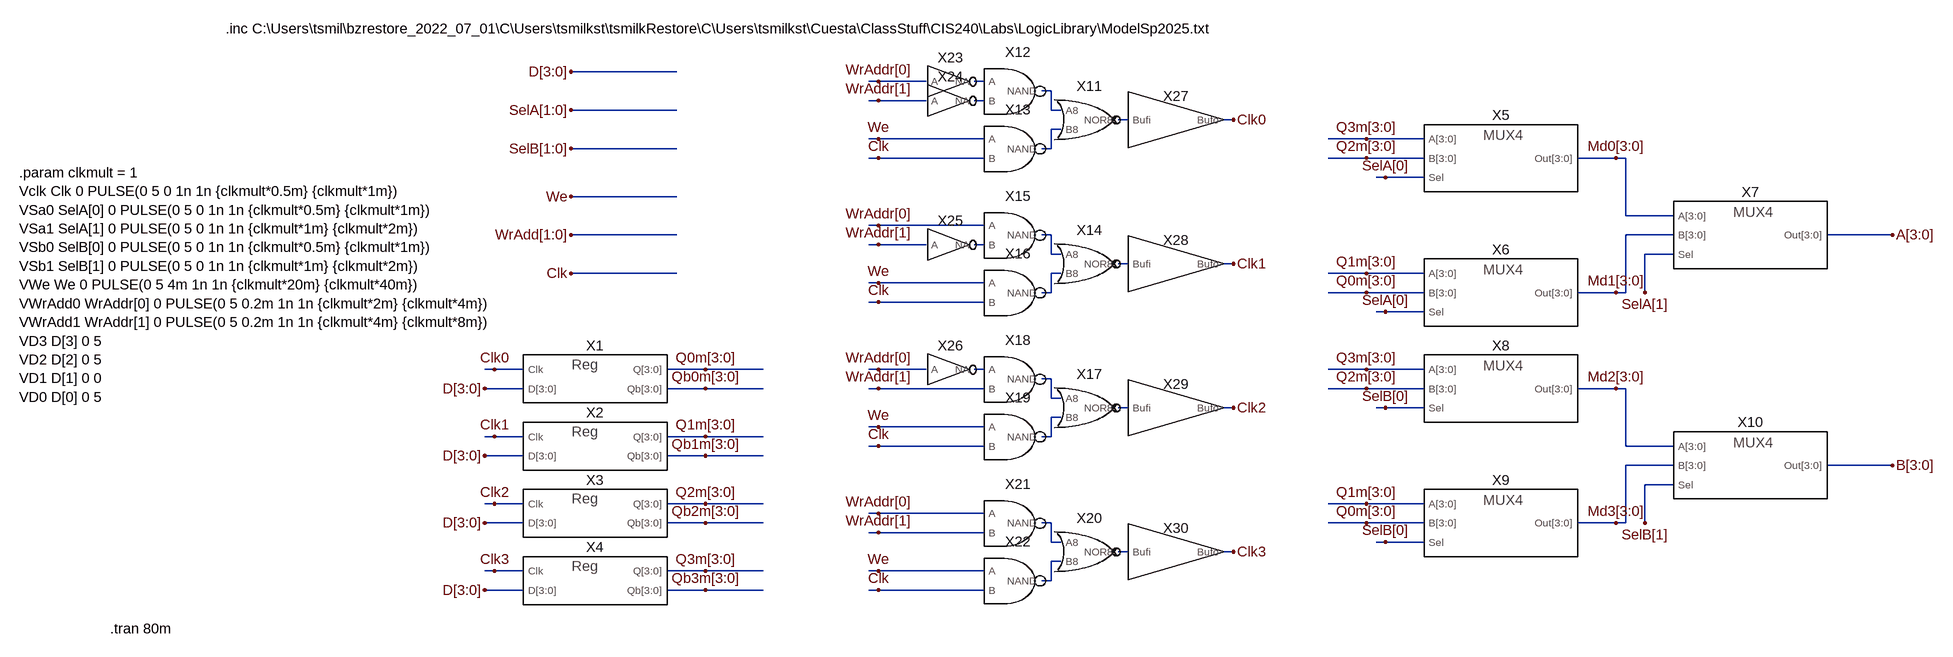
[diagram p0: schematic REGISTERBANKRAWTEST.asc]
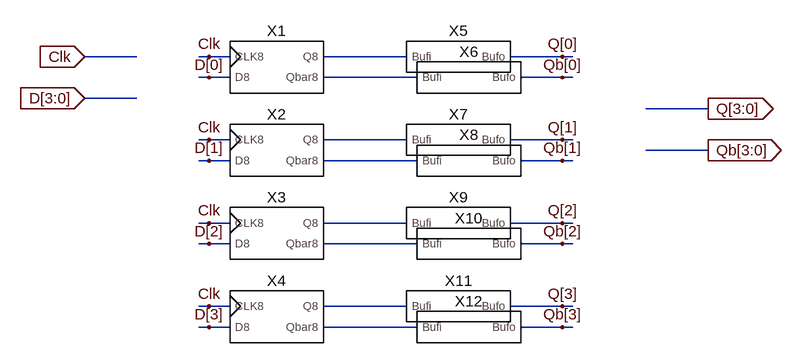
[diagram p1: sub-circuit register.asc]
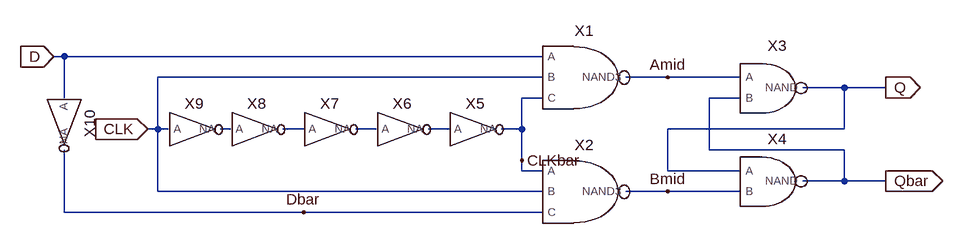
[diagram p2: sub-circuit dff.asc]
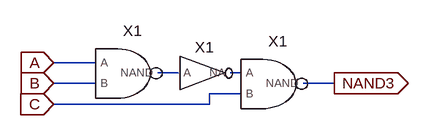
[diagram p3: sub-circuit nand3.asc]
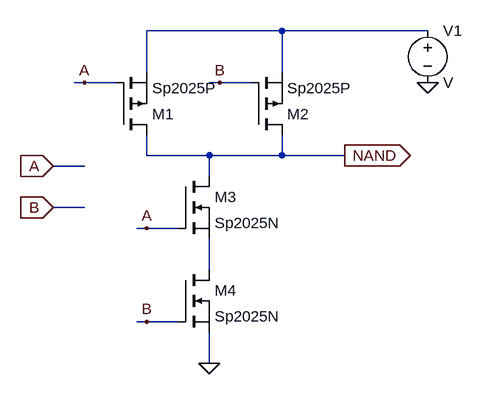
[diagram p4: sub-circuit nand.asc]
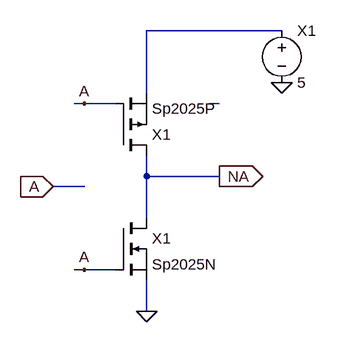
[diagram p5: sub-circuit invert.asc]
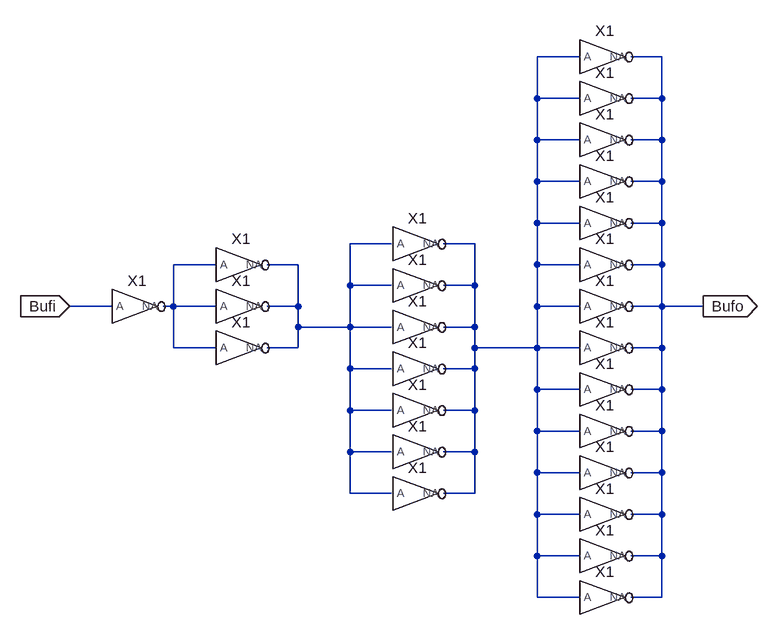
[diagram p6: sub-circuit buffer2x.asc]
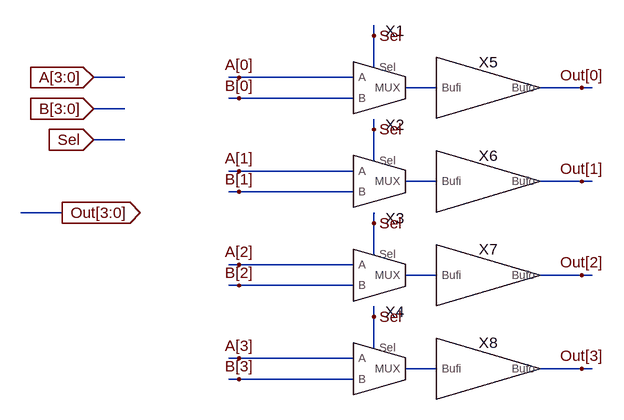
[diagram p7: sub-circuit mux4.asc]
REGISTERBANKRAWTEST.asc, the LTspice schematic file:
Version 4
SHEET 1 880 680
WIRE -144 -432 -320 -432
WIRE 192 -416 176 -416
WIRE 272 -416 192 -416
WIRE 368 -416 352 -416
WIRE 480 -400 464 -400
WIRE 192 -384 176 -384
WIRE 272 -384 192 -384
WIRE 368 -384 352 -384
WIRE -144 -368 -320 -368
WIRE 480 -368 480 -400
WIRE 496 -368 480 -368
WIRE 608 -352 592 -352
WIRE 784 -352 768 -352
WIRE 496 -336 480 -336
WIRE 192 -320 176 -320
WIRE 368 -320 192 -320
WIRE 1152 -320 1088 -320
WIRE 1248 -320 1152 -320
WIRE -144 -304 -320 -304
WIRE 480 -304 480 -336
WIRE 480 -304 464 -304
WIRE 192 -288 176 -288
WIRE 368 -288 192 -288
WIRE 1152 -288 1088 -288
WIRE 1248 -288 1152 -288
WIRE 1568 -288 1504 -288
WIRE 1584 -288 1568 -288
WIRE 1184 -256 1168 -256
WIRE 1248 -256 1184 -256
WIRE -144 -224 -320 -224
WIRE 1584 -192 1584 -288
WIRE 1664 -192 1584 -192
WIRE 192 -176 176 -176
WIRE 368 -176 192 -176
WIRE -144 -160 -320 -160
WIRE 480 -160 464 -160
WIRE 1664 -160 1584 -160
WIRE 2112 -160 1920 -160
WIRE 192 -144 176 -144
WIRE 272 -144 192 -144
WIRE 368 -144 352 -144
WIRE 480 -128 480 -160
WIRE 496 -128 480 -128
WIRE 1664 -128 1616 -128
WIRE 608 -112 592 -112
WIRE 784 -112 768 -112
WIRE -144 -96 -320 -96
WIRE 496 -96 480 -96
WIRE 1152 -96 1088 -96
WIRE 1248 -96 1152 -96
WIRE 192 -80 176 -80
WIRE 368 -80 192 -80
WIRE 480 -64 480 -96
WIRE 480 -64 464 -64
WIRE 1152 -64 1088 -64
WIRE 1248 -64 1152 -64
WIRE 1568 -64 1504 -64
WIRE 1584 -64 1584 -160
WIRE 1584 -64 1568 -64
WIRE 1616 -64 1616 -128
WIRE 192 -48 176 -48
WIRE 368 -48 192 -48
WIRE 1184 -32 1168 -32
WIRE 1248 -32 1184 -32
WIRE -448 64 -464 64
WIRE -400 64 -448 64
WIRE -96 64 -160 64
WIRE 0 64 -96 64
WIRE 192 64 176 64
WIRE 272 64 192 64
WIRE 368 64 352 64
WIRE 1152 64 1088 64
WIRE 1248 64 1152 64
WIRE 480 80 464 80
WIRE -400 96 -464 96
WIRE -96 96 -160 96
WIRE 0 96 -96 96
WIRE 192 96 176 96
WIRE 368 96 192 96
WIRE 1152 96 1088 96
WIRE 1248 96 1152 96
WIRE 1568 96 1504 96
WIRE 1584 96 1568 96
WIRE 480 112 480 80
WIRE 496 112 480 112
WIRE 608 128 592 128
WIRE 784 128 768 128
WIRE 1184 128 1168 128
WIRE 1248 128 1184 128
WIRE 496 144 480 144
WIRE 192 160 176 160
WIRE 368 160 192 160
WIRE -448 176 -464 176
WIRE -400 176 -448 176
WIRE -96 176 -160 176
WIRE 0 176 -96 176
WIRE 480 176 480 144
WIRE 480 176 464 176
WIRE 192 192 176 192
WIRE 368 192 192 192
WIRE 1584 192 1584 96
WIRE 1664 192 1584 192
WIRE -400 208 -464 208
WIRE -96 208 -160 208
WIRE 0 208 -96 208
WIRE 1664 224 1584 224
WIRE 2112 224 1920 224
WIRE 1664 256 1616 256
WIRE -448 288 -464 288
WIRE -400 288 -448 288
WIRE -96 288 -160 288
WIRE 0 288 -96 288
WIRE 1152 288 1088 288
WIRE 1248 288 1152 288
WIRE 192 304 176 304
WIRE 368 304 192 304
WIRE -400 320 -464 320
WIRE -96 320 -160 320
WIRE 0 320 -96 320
WIRE 480 320 464 320
WIRE 1152 320 1088 320
WIRE 1248 320 1152 320
WIRE 1568 320 1504 320
WIRE 1584 320 1584 224
WIRE 1584 320 1568 320
WIRE 1616 320 1616 256
WIRE 192 336 176 336
WIRE 368 336 192 336
WIRE 480 352 480 320
WIRE 496 352 480 352
WIRE 1184 352 1168 352
WIRE 1248 352 1184 352
WIRE 608 368 592 368
WIRE 784 368 768 368
WIRE 496 384 480 384
WIRE -448 400 -464 400
WIRE -400 400 -448 400
WIRE -96 400 -160 400
WIRE 0 400 -96 400
WIRE 192 400 176 400
WIRE 368 400 192 400
WIRE 480 416 480 384
WIRE 480 416 464 416
WIRE -400 432 -464 432
WIRE -96 432 -160 432
WIRE 0 432 -96 432
WIRE 192 432 176 432
WIRE 368 432 192 432
FLAG -96 64 Q0m[3:0]
FLAG -96 96 Qb0m[3:0]
FLAG -448 64 Clk0
FLAG -96 176 Q1m[3:0]
FLAG -96 208 Qb1m[3:0]
FLAG -448 176 Clk1
FLAG -96 288 Q2m[3:0]
FLAG -96 320 Qb2m[3:0]
FLAG -448 288 Clk2
FLAG -96 400 Q3m[3:0]
FLAG -96 432 Qb3m[3:0]
FLAG -448 400 Clk3
FLAG 2112 -160 A[3:0]
FLAG 2112 224 B[3:0]
FLAG -320 -160 WrAdd[1:0]
FLAG -320 -96 Clk
FLAG 1184 -256 SelA[0]
FLAG 1616 -64 SelA[1]
FLAG 1616 320 SelB[1]
FLAG -320 -432 D[3:0]
FLAG -464 96 D[3:0]
FLAG -464 208 D[3:0]
FLAG -464 320 D[3:0]
FLAG -464 432 D[3:0]
FLAG -320 -368 SelA[1:0]
FLAG 1184 -32 SelA[0]
FLAG 1184 128 SelB[0]
FLAG 1184 352 SelB[0]
FLAG 1152 -64 Q0m[3:0]
FLAG 1152 -96 Q1m[3:0]
FLAG 1152 -288 Q2m[3:0]
FLAG 1152 -320 Q3m[3:0]
FLAG 1152 96 Q2m[3:0]
FLAG 1152 64 Q3m[3:0]
FLAG 1152 320 Q0m[3:0]
FLAG 1152 288 Q1m[3:0]
FLAG -320 -304 SelB[1:0]
FLAG -320 -224 We
FLAG 784 -352 Clk0
FLAG 192 -320 We
FLAG 192 -416 WrAddr[0]
FLAG 192 -384 WrAddr[1]
FLAG 192 -288 Clk
FLAG 784 -112 Clk1
FLAG 192 -80 We
FLAG 192 -176 WrAddr[0]
FLAG 192 -144 WrAddr[1]
FLAG 192 -48 Clk
FLAG 784 128 Clk2
FLAG 192 160 We
FLAG 192 64 WrAddr[0]
FLAG 192 96 WrAddr[1]
FLAG 192 192 Clk
FLAG 784 368 Clk3
FLAG 192 400 We
FLAG 192 304 WrAddr[0]
FLAG 192 336 WrAddr[1]
FLAG 192 432 Clk
FLAG 1568 -288 Md0[3:0]
FLAG 1568 -64 Md1[3:0]
FLAG 1568 96 Md2[3:0]
FLAG 1568 320 Md3[3:0]
SYMBOL Register -288 192 R0
SYMATTR InstName X2
SYMBOL Register -288 304 R0
SYMATTR InstName X3
SYMBOL Register -288 416 R0
SYMATTR InstName X4
SYMBOL MUX4 1376 -288 R0
SYMATTR InstName X5
SYMBOL MUX4 1376 -64 R0
SYMATTR InstName X6
SYMBOL MUX4 1792 -160 R0
SYMATTR InstName X7
SYMBOL MUX4 1376 96 R0
SYMATTR InstName X8
SYMBOL MUX4 1376 320 R0
SYMATTR InstName X9
SYMBOL MUX4 1792 224 R0
SYMATTR InstName X10
SYMBOL NOR 544 -352 R0
SYMATTR InstName X11
SYMBOL NAND 416 -400 R0
SYMATTR InstName X12
SYMBOL NAND 416 -304 R0
SYMATTR InstName X13
SYMBOL NOR 544 -112 R0
SYMATTR InstName X14
SYMBOL NAND 416 -160 R0
SYMATTR InstName X15
SYMBOL NAND 416 -64 R0
SYMATTR InstName X16
SYMBOL NOR 544 128 R0
SYMATTR InstName X17
SYMBOL NAND 416 80 R0
SYMATTR InstName X18
SYMBOL NAND 416 176 R0
SYMATTR InstName X19
SYMBOL NOR 544 368 R0
SYMATTR InstName X20
SYMBOL NAND 416 320 R0
SYMATTR InstName X21
SYMBOL NAND 416 416 R0
SYMATTR InstName X22
SYMBOL INVERT 304 -416 R0
SYMATTR InstName X23
SYMBOL INVERT 304 -384 R0
SYMATTR InstName X24
SYMBOL INVERT 304 -144 R0
SYMATTR InstName X25
SYMBOL INVERT 304 64 R0
SYMATTR InstName X26
SYMBOL Register -288 80 R0
SYMATTR InstName X1
SYMBOL Buffer 688 -352 R0
SYMATTR InstName X27
SYMBOL Buffer 688 -112 R0
SYMATTR InstName X28
SYMBOL Buffer 688 128 R0
SYMATTR InstName X29
SYMBOL Buffer 688 368 R0
SYMATTR InstName X30
TEXT -1240 -264 Left 2 !.param clkmult = 1\nVclk Clk 0 PULSE(0 5 0 1n 1n {clkmult*0.5m} {clkmult*1m})\nVSa0 SelA[0] 0 PULSE(0 5 0 1n 1n {clkmult*0.5m} {clkmult*1m})\nVSa1 SelA[1] 0 PULSE(0 5 0 1n 1n {clkmult*1m} {clkmult*2m})\nVSb0 SelB[0] 0 PULSE(0 5 0 1n 1n {clkmult*0.5m} {clkmult*1m})\nVSb1 SelB[1] 0 PULSE(0 5 0 1n 1n {clkmult*1m} {clkmult*2m})\nVWe We 0 PULSE(0 5 4m 1n 1n {clkmult*20m} {clkmult*40m})\nVWrAdd0 WrAddr[0] 0 PULSE(0 5 0.2m 1n 1n {clkmult*2m} {clkmult*4m})\nVWrAdd1 WrAddr[1] 0 PULSE(0 5 0.2m 1n 1n {clkmult*4m} {clkmult*8m})\nVD3 D[3] 0 5\nVD2 D[2] 0 5\nVD1 D[1] 0 0\nVD0 D[0] 0 5
TEXT -896 -504 Left 2 !.inc C:\\Users\\tsmil\\bzrestore_2022_07_01\\C\\Users\\tsmilkst\\tsmilkRestore\\C\\Users\\tsmilkst\\Cuesta\\ClassStuff\\CIS240\\Labs\\LogicLibrary\\ModelSp2025.txt
TEXT -1088 496 Left 2 !.tran 80m

register.asc, the sub-circuit schematic file:
Version 4
SHEET 1 880 680
WIRE -48 96 -128 96
WIRE 64 96 48 96
WIRE 96 96 64 96
WIRE 368 96 240 96
WIRE 608 96 528 96
WIRE 624 96 608 96
WIRE 64 128 48 128
WIRE 96 128 64 128
WIRE 384 128 240 128
WIRE 608 128 544 128
WIRE 624 128 608 128
WIRE -48 160 -128 160
WIRE 832 176 736 176
WIRE 64 224 48 224
WIRE 96 224 64 224
WIRE 368 224 240 224
WIRE 608 224 528 224
WIRE 624 224 608 224
WIRE 832 240 736 240
WIRE 64 256 48 256
WIRE 96 256 64 256
WIRE 384 256 240 256
WIRE 608 256 544 256
WIRE 624 256 608 256
WIRE 64 352 48 352
WIRE 96 352 64 352
WIRE 368 352 240 352
WIRE 608 352 528 352
WIRE 624 352 608 352
WIRE 64 384 48 384
WIRE 96 384 64 384
WIRE 384 384 240 384
WIRE 608 384 544 384
WIRE 624 384 608 384
WIRE 64 480 48 480
WIRE 96 480 64 480
WIRE 368 480 240 480
WIRE 608 480 528 480
WIRE 624 480 608 480
WIRE 64 512 48 512
WIRE 96 512 64 512
WIRE 384 512 240 512
WIRE 608 512 544 512
WIRE 624 512 608 512
FLAG 64 96 Clk
FLAG 64 128 D[0]
FLAG 608 96 Q[0]
FLAG 608 128 Qb[0]
FLAG 64 224 Clk
FLAG 64 256 D[1]
FLAG 608 224 Q[1]
FLAG 608 256 Qb[1]
FLAG 64 352 Clk
FLAG 64 384 D[2]
FLAG 608 352 Q[2]
FLAG 608 384 Qb[2]
FLAG 64 480 Clk
FLAG 64 512 D[3]
FLAG 608 480 Q[3]
FLAG 608 512 Qb[3]
FLAG -128 96 Clk
IOPIN -128 96 In
FLAG -128 160 D[3:0]
IOPIN -128 160 In
FLAG 832 176 Q[3:0]
IOPIN 832 176 Out
FLAG 832 240 Qb[3:0]
IOPIN 832 240 Out
SYMBOL dff 160 112 R0
SYMATTR InstName X1
SYMBOL dff 160 240 R0
SYMATTR InstName X2
SYMBOL dff 160 368 R0
SYMATTR InstName X3
SYMBOL dff 160 496 R0
SYMATTR InstName X4
SYMBOL Buffer2x 448 96 R0
SYMATTR InstName X5
SYMBOL Buffer2x 464 128 R0
SYMATTR InstName X6
SYMBOL Buffer2x 448 224 R0
SYMATTR InstName X7
SYMBOL Buffer2x 464 256 R0
SYMATTR InstName X8
SYMBOL Buffer2x 448 352 R0
SYMATTR InstName X9
SYMBOL Buffer2x 464 384 R0
SYMATTR InstName X10
SYMBOL Buffer2x 448 480 R0
SYMATTR InstName X11
SYMBOL Buffer2x 464 512 R0
SYMATTR InstName X12

dff.asc, the sub-circuit schematic file:
Version 4.1
SHEET 1 880 680
WIRE -592 64 -608 64
WIRE 144 64 -592 64
WIRE 144 96 -448 96
WIRE 336 96 272 96
WIRE 448 96 336 96
WIRE 608 112 544 112
WIRE 672 112 608 112
WIRE -592 128 -592 64
WIRE 144 128 112 128
WIRE 448 128 400 128
WIRE -448 176 -448 96
WIRE -448 176 -464 176
WIRE -432 176 -448 176
WIRE -336 176 -352 176
WIRE -224 176 -256 176
WIRE -112 176 -144 176
WIRE 0 176 -32 176
WIRE 112 176 112 128
WIRE 112 176 80 176
WIRE 608 176 608 112
WIRE 608 176 336 176
WIRE 400 208 400 128
WIRE 608 208 400 208
WIRE 112 224 112 176
WIRE 112 240 112 224
WIRE 144 240 112 240
WIRE 336 240 336 176
WIRE 448 240 336 240
WIRE 608 256 608 208
WIRE 608 256 544 256
WIRE 672 256 608 256
WIRE -448 272 -448 176
WIRE 144 272 -448 272
WIRE 336 272 272 272
WIRE 448 272 336 272
WIRE -592 304 -592 208
WIRE -224 304 -592 304
WIRE 144 304 -224 304
FLAG -608 64 D
IOPIN -608 64 In
FLAG -464 176 CLK
IOPIN -464 176 In
FLAG 672 112 Q
IOPIN 672 112 Out
FLAG 672 256 Qbar
IOPIN 672 256 Out
FLAG -224 304 Dbar
FLAG 336 96 Amid
FLAG 336 272 Bmid
FLAG 112 224 CLKbar
SYMBOL NAND3 208 96 R0
SYMATTR InstName X1
SYMBOL NAND3 208 272 R0
SYMATTR InstName X2
SYMBOL INVERT 32 176 R0
SYMATTR InstName X5
SYMBOL INVERT -80 176 R0
SYMATTR InstName X6
SYMBOL INVERT -192 176 R0
SYMATTR InstName X7
SYMBOL INVERT -304 176 R0
SYMATTR InstName X8
SYMBOL INVERT -400 176 R0
SYMATTR InstName X9
SYMBOL NAND 496 112 R0
SYMATTR InstName X3
SYMBOL NAND 496 256 R0
SYMATTR InstName X4
SYMBOL INVERT -592 160 R90
SYMATTR InstName X10

nand3.asc, the sub-circuit schematic file:
Version 4
SHEET 1 880 680
WIRE 80 80 16 80
WIRE 208 96 176 96
WIRE 304 96 288 96
WIRE 80 112 16 112
WIRE 448 112 400 112
WIRE 304 128 256 128
WIRE 256 144 256 128
WIRE 256 144 16 144
FLAG 16 80 A
IOPIN 16 80 In
FLAG 16 112 B
IOPIN 16 112 In
FLAG 16 144 C
IOPIN 16 144 In
FLAG 448 112 NAND3
IOPIN 448 112 Out
SYMBOL NAND 128 96 R0
SYMATTR InstName X1
SYMBOL NAND 352 112 R0
SYMATTR InstName X1
SYMBOL INVERT 240 96 R0
SYMATTR InstName X1

nand.asc, the sub-circuit schematic file:
Version 4
SHEET 1 880 680
.lib SHEET 1 880 680
WIRE 336 -160 128 -160
WIRE 560 -160 336 -160
WIRE 128 -96 128 -160
WIRE 336 -96 336 -160
WIRE 32 -80 16 -80
WIRE 80 -80 32 -80
WIRE 240 -80 224 -80
WIRE 288 -80 240 -80
WIRE 128 32 128 0
WIRE 224 32 128 32
WIRE 336 32 336 0
WIRE 336 32 224 32
WIRE 432 32 336 32
WIRE 32 48 -16 48
WIRE 224 64 224 32
WIRE 32 112 -16 112
WIRE 128 144 112 144
WIRE 176 144 128 144
WIRE 224 208 224 160
WIRE 128 288 112 288
WIRE 176 288 128 288
WIRE 224 352 224 304
FLAG 224 352 0
FLAG -16 48 A
IOPIN -16 48 In
FLAG -16 112 B
IOPIN -16 112 In
FLAG 128 144 A
FLAG 128 288 B
FLAG 32 -80 A
FLAG 240 -80 B
FLAG 432 32 NAND
IOPIN 432 32 Out
FLAG 560 -80 0
SYMBOL pmos 80 0 M180
SYMATTR InstName M1
SYMATTR Value Sp2025P
SYMBOL pmos 288 0 M180
SYMATTR InstName M2
SYMATTR Value Sp2025P
SYMBOL nmos 176 64 R0
SYMATTR InstName M3
SYMATTR Value Sp2025N
SYMBOL nmos 176 208 R0
SYMATTR InstName M4
SYMATTR Value Sp2025N
SYMBOL voltage 560 -176 R0
SYMATTR InstName V1

invert.asc, the sub-circuit schematic file:
Version 4
SHEET 1 880 680
WIRE 352 -80 144 -80
WIRE 144 16 144 -80
WIRE 48 32 32 32
WIRE 96 32 48 32
WIRE 256 32 240 32
WIRE 144 144 144 112
WIRE 256 144 144 144
WIRE 48 160 0 160
WIRE 144 208 144 144
WIRE 48 288 32 288
WIRE 96 288 48 288
WIRE 144 352 144 304
FLAG 144 352 0
FLAG 0 160 A
IOPIN 0 160 In
FLAG 48 288 A
FLAG 48 32 A
FLAG 256 144 NA
IOPIN 256 144 Out
FLAG 352 0 0
SYMBOL pmos 96 112 M180
SYMATTR InstName X1
SYMATTR Value Sp2025P
SYMBOL nmos 96 208 R0
SYMATTR InstName X1
SYMATTR Value Sp2025N
SYMBOL voltage 352 -96 R0
SYMATTR InstName X1
SYMATTR Value 5

buffer2x.asc, the sub-circuit schematic file:
Version 4
SHEET 1 880 680
WIRE 784 -256 720 -256
WIRE 912 -256 864 -256
WIRE 720 -192 720 -256
WIRE 784 -192 720 -192
WIRE 912 -192 912 -256
WIRE 912 -192 864 -192
WIRE 720 -128 720 -192
WIRE 784 -128 720 -128
WIRE 912 -128 912 -192
WIRE 912 -128 864 -128
WIRE 720 -64 720 -128
WIRE 784 -64 720 -64
WIRE 912 -64 912 -128
WIRE 912 -64 864 -64
WIRE 720 0 720 -64
WIRE 784 0 720 0
WIRE 912 0 912 -64
WIRE 912 0 864 0
WIRE 496 32 432 32
WIRE 624 32 576 32
WIRE 224 64 160 64
WIRE 352 64 304 64
WIRE 720 64 720 0
WIRE 784 64 720 64
WIRE 912 64 912 0
WIRE 912 64 864 64
WIRE 432 96 432 32
WIRE 496 96 432 96
WIRE 624 96 624 32
WIRE 624 96 576 96
WIRE 64 128 0 128
WIRE 160 128 160 64
WIRE 160 128 144 128
WIRE 224 128 160 128
WIRE 352 128 352 64
WIRE 352 128 304 128
WIRE 720 128 720 64
WIRE 784 128 720 128
WIRE 912 128 912 64
WIRE 912 128 864 128
WIRE 976 128 912 128
WIRE 352 160 352 128
WIRE 432 160 432 96
WIRE 432 160 352 160
WIRE 496 160 432 160
WIRE 624 160 624 96
WIRE 624 160 576 160
WIRE 160 192 160 128
WIRE 224 192 160 192
WIRE 352 192 352 160
WIRE 352 192 304 192
WIRE 624 192 624 160
WIRE 720 192 720 128
WIRE 720 192 624 192
WIRE 784 192 720 192
WIRE 912 192 912 128
WIRE 912 192 864 192
WIRE 432 224 432 160
WIRE 496 224 432 224
WIRE 624 224 624 192
WIRE 624 224 576 224
WIRE 720 256 720 192
WIRE 784 256 720 256
WIRE 912 256 912 192
WIRE 912 256 864 256
WIRE 432 288 432 224
WIRE 496 288 432 288
WIRE 624 288 624 224
WIRE 624 288 576 288
WIRE 720 320 720 256
WIRE 784 320 720 320
WIRE 912 320 912 256
WIRE 912 320 864 320
WIRE 432 352 432 288
WIRE 496 352 432 352
WIRE 624 352 624 288
WIRE 624 352 576 352
WIRE 720 384 720 320
WIRE 784 384 720 384
WIRE 912 384 912 320
WIRE 912 384 864 384
WIRE 432 416 432 352
WIRE 496 416 432 416
WIRE 624 416 624 352
WIRE 624 416 576 416
WIRE 720 448 720 384
WIRE 784 448 720 448
WIRE 912 448 912 384
WIRE 912 448 864 448
WIRE 720 512 720 448
WIRE 784 512 720 512
WIRE 912 512 912 448
WIRE 912 512 864 512
WIRE 720 576 720 512
WIRE 784 576 720 576
WIRE 912 576 912 512
WIRE 912 576 864 576
FLAG 0 128 Bufi
IOPIN 0 128 In
FLAG 976 128 Bufo
IOPIN 976 128 Out
SYMBOL INVERT 96 128 R0
SYMATTR InstName X1
SYMBOL INVERT 256 64 R0
SYMATTR InstName X1
SYMBOL INVERT 256 128 R0
SYMATTR InstName X1
SYMBOL INVERT 256 192 R0
SYMATTR InstName X1
SYMBOL INVERT 528 32 R0
SYMATTR InstName X1
SYMBOL INVERT 528 96 R0
SYMATTR InstName X1
SYMBOL INVERT 528 160 R0
SYMATTR InstName X1
SYMBOL INVERT 528 224 R0
SYMATTR InstName X1
SYMBOL INVERT 528 288 R0
SYMATTR InstName X1
SYMBOL INVERT 528 352 R0
SYMATTR InstName X1
SYMBOL INVERT 528 416 R0
SYMATTR InstName X1
SYMBOL INVERT 816 -256 R0
SYMATTR InstName X1
SYMBOL INVERT 816 -192 R0
SYMATTR InstName X1
SYMBOL INVERT 816 -128 R0
SYMATTR InstName X1
SYMBOL INVERT 816 -64 R0
SYMATTR InstName X1
SYMBOL INVERT 816 0 R0
SYMATTR InstName X1
SYMBOL INVERT 816 64 R0
SYMATTR InstName X1
SYMBOL INVERT 816 128 R0
SYMATTR InstName X1
SYMBOL INVERT 816 192 R0
SYMATTR InstName X1
SYMBOL INVERT 816 256 R0
SYMATTR InstName X1
SYMBOL INVERT 816 320 R0
SYMATTR InstName X1
SYMBOL INVERT 816 384 R0
SYMATTR InstName X1
SYMBOL INVERT 816 448 R0
SYMATTR InstName X1
SYMBOL INVERT 816 512 R0
SYMATTR InstName X1
SYMBOL INVERT 816 576 R0
SYMATTR InstName X1

mux4.asc, the sub-circuit schematic file:
Version 4
SHEET 1 880 680
WIRE 176 48 176 32
WIRE 176 96 176 48
WIRE -208 112 -256 112
WIRE -32 112 -48 112
WIRE 144 112 -32 112
WIRE 272 128 224 128
WIRE 496 128 432 128
WIRE 512 128 496 128
WIRE -32 144 -48 144
WIRE 144 144 -32 144
WIRE -208 160 -256 160
WIRE 176 192 176 176
WIRE -208 208 -256 208
WIRE 176 240 176 192
WIRE -32 256 -48 256
WIRE 144 256 -32 256
WIRE 272 272 224 272
WIRE 496 272 432 272
WIRE 512 272 496 272
WIRE -32 288 -48 288
WIRE 144 288 -32 288
WIRE -304 320 -368 320
WIRE 176 336 176 320
WIRE 176 384 176 336
WIRE -32 400 -48 400
WIRE 144 400 -32 400
WIRE 272 416 224 416
WIRE 496 416 432 416
WIRE 512 416 496 416
WIRE -32 432 -48 432
WIRE 144 432 -32 432
WIRE 176 480 176 464
WIRE 176 528 176 480
WIRE -32 544 -48 544
WIRE 144 544 -32 544
WIRE 272 560 224 560
WIRE 496 560 432 560
WIRE 512 560 496 560
WIRE -32 576 -48 576
WIRE 144 576 -32 576
FLAG 176 48 Sel
FLAG -256 112 A[3:0]
IOPIN -256 112 In
FLAG -256 160 B[3:0]
IOPIN -256 160 In
FLAG -256 208 Sel
IOPIN -256 208 In
FLAG -32 112 A[0]
FLAG -32 144 B[0]
FLAG 496 128 Out[0]
FLAG -304 320 Out[3:0]
IOPIN -304 320 Out
FLAG 176 192 Sel
FLAG -32 256 A[1]
FLAG -32 288 B[1]
FLAG 496 272 Out[1]
FLAG 176 336 Sel
FLAG -32 400 A[2]
FLAG -32 432 B[2]
FLAG 496 416 Out[2]
FLAG 176 480 Sel
FLAG -32 544 A[3]
FLAG -32 576 B[3]
FLAG 496 560 Out[3]
SYMBOL MUX 208 112 R0
SYMATTR InstName X1
SYMBOL MUX 208 256 R0
SYMATTR InstName X2
SYMBOL MUX 208 400 R0
SYMATTR InstName X3
SYMBOL MUX 208 544 R0
SYMATTR InstName X4
SYMBOL Buffer 352 128 R0
SYMATTR InstName X5
SYMBOL Buffer 352 272 R0
SYMATTR InstName X6
SYMBOL Buffer 352 416 R0
SYMATTR InstName X7
SYMBOL Buffer 352 560 R0
SYMATTR InstName X8

mux.asc, the sub-circuit schematic file:
Version 4
SHEET 1 880 680
WIRE 96 80 -80 80
WIRE 240 96 192 96
WIRE 96 112 -48 112
WIRE -48 144 -48 112
WIRE -48 144 -80 144
WIRE 240 144 240 96
WIRE 288 144 240 144
WIRE 432 160 384 160
WIRE 288 176 240 176
WIRE -48 224 -48 144
WIRE -16 224 -48 224
WIRE 96 224 64 224
WIRE 240 240 240 176
WIRE 240 240 192 240
WIRE 96 256 -80 256
FLAG 432 160 MUX
IOPIN 432 160 Out
FLAG -80 80 A
IOPIN -80 80 In
FLAG -80 256 B
IOPIN -80 256 In
FLAG -80 144 Sel
IOPIN -80 144 In
SYMBOL NAND 144 96 R0
SYMATTR InstName X1
SYMBOL NAND 144 240 R0
SYMATTR InstName X2
SYMBOL NAND 336 160 R0
SYMATTR InstName X3
SYMBOL INVERT 16 224 R0
SYMATTR InstName X4

buffer.asc, the sub-circuit schematic file:
Version 4
SHEET 1 880 680
WIRE 224 64 160 64
WIRE 352 64 304 64
WIRE 64 128 0 128
WIRE 160 128 160 64
WIRE 160 128 144 128
WIRE 224 128 160 128
WIRE 352 128 352 64
WIRE 352 128 304 128
WIRE 416 128 352 128
WIRE 160 192 160 128
WIRE 224 192 160 192
WIRE 352 192 352 128
WIRE 352 192 304 192
FLAG 0 128 Bufi
IOPIN 0 128 In
FLAG 416 128 Bufo
IOPIN 416 128 Out
SYMBOL INVERT 96 128 R0
SYMATTR InstName X1
SYMBOL INVERT 256 64 R0
SYMATTR InstName X2
SYMBOL INVERT 256 128 R0
SYMATTR InstName X3
SYMBOL INVERT 256 192 R0
SYMATTR InstName X4

nor.asc, the sub-circuit schematic file:
Version 4
SHEET 1 880 680
WIRE 432 -320 224 -320
WIRE 224 -256 224 -320
WIRE 176 -240 128 -240
WIRE 224 -96 224 -160
WIRE 128 -80 112 -80
WIRE 176 -80 128 -80
WIRE 336 -80 320 -80
WIRE 224 32 224 0
WIRE 336 32 224 32
WIRE 128 48 80 48
WIRE 128 112 80 112
WIRE 224 144 224 32
WIRE 480 144 224 144
WIRE 224 208 224 144
WIRE 480 208 480 144
WIRE 128 288 112 288
WIRE 176 288 128 288
WIRE 384 288 368 288
WIRE 432 288 384 288
WIRE 224 352 224 304
WIRE 480 352 480 304
FLAG 224 352 0
FLAG 80 48 A
IOPIN 80 48 In
FLAG 80 112 B
IOPIN 80 112 In
FLAG 384 288 A
FLAG 128 288 B
FLAG 128 -80 A
FLAG 128 -240 B
FLAG 336 32 NOR
IOPIN 336 32 Out
FLAG 480 352 0
FLAG 432 -240 0
SYMBOL pmos 176 0 M180
SYMATTR InstName X1
SYMATTR Value Sp2025P
SYMBOL pmos 176 -160 M180
SYMATTR InstName X1
SYMATTR Value Sp2025P
SYMBOL nmos 432 208 R0
SYMATTR InstName X1
SYMATTR Value Sp2025N
SYMBOL nmos 176 208 R0
SYMATTR InstName X1
SYMATTR Value Sp2025N
SYMBOL voltage 432 -336 R0
SYMATTR InstName X1
SYMATTR Value 5

The netlist it stands for:
* REGISTERBANKRAWTEST.asc
XX2 Clk1 D[3] D[2] D[1] D[0] Q1m[3] Q1m[2] Q1m[1] Q1m[0] Qb1m[3] Qb1m[2] Qb1m[1] Qb1m[0] register
XX3 Clk2 D[3] D[2] D[1] D[0] Q2m[3] Q2m[2] Q2m[1] Q2m[0] Qb2m[3] Qb2m[2] Qb2m[1] Qb2m[0] register
XX4 Clk3 D[3] D[2] D[1] D[0] Q3m[3] Q3m[2] Q3m[1] Q3m[0] Qb3m[3] Qb3m[2] Qb3m[1] Qb3m[0] register
XX5 Q3m[3] Q3m[2] Q3m[1] Q3m[0] Q2m[3] Q2m[2] Q2m[1] Q2m[0] SelA[0] Md0[3] Md0[2] Md0[1] Md0[0] mux4
XX6 Q1m[3] Q1m[2] Q1m[1] Q1m[0] Q0m[3] Q0m[2] Q0m[1] Q0m[0] SelA[0] Md1[3] Md1[2] Md1[1] Md1[0] mux4
XX7 Md0[3] Md0[2] Md0[1] Md0[0] Md1[3] Md1[2] Md1[1] Md1[0] SelA[1] A[3] A[2] A[1] A[0] mux4
XX8 Q3m[3] Q3m[2] Q3m[1] Q3m[0] Q2m[3] Q2m[2] Q2m[1] Q2m[0] SelB[0] Md2[3] Md2[2] Md2[1] Md2[0] mux4
XX9 Q1m[3] Q1m[2] Q1m[1] Q1m[0] Q0m[3] Q0m[2] Q0m[1] Q0m[0] SelB[0] Md3[3] Md3[2] Md3[1] Md3[0] mux4
XX10 Md2[3] Md2[2] Md2[1] Md2[0] Md3[3] Md3[2] Md3[1] Md3[0] SelB[1] B[3] B[2] B[1] B[0] mux4
XX11 N002 N005 N004 nor
XX12 N001 N003 N002 nand
XX13 We Clk N005 nand
XX14 N006 N009 N008 nor
XX15 WrAddr[0] N007 N006 nand
XX16 We Clk N009 nand
XX17 N011 N013 N012 nor
XX18 N010 WrAddr[1] N011 nand
XX19 We Clk N013 nand
XX20 N014 N016 N015 nor
XX21 WrAddr[0] WrAddr[1] N014 nand
XX22 We Clk N016 nand
XX23 WrAddr[0] N001 invert
XX24 WrAddr[1] N003 invert
XX25 WrAddr[1] N007 invert
XX26 WrAddr[0] N010 invert
XX1 Clk0 D[3] D[2] D[1] D[0] Q0m[3] Q0m[2] Q0m[1] Q0m[0] Qb0m[3] Qb0m[2] Qb0m[1] Qb0m[0] register
XX27 N004 Clk0 buffer
XX28 N008 Clk1 buffer
XX29 N012 Clk2 buffer
XX30 N015 Clk3 buffer

* block symbol definitions
.subckt register Clk D[3] D[2] D[1] D[0] Q[3] Q[2] Q[1] Q[0] Qb[3] Qb[2] Qb[1] Qb[0]
XX1 Clk D[0] N001 N002 dff
XX2 Clk D[1] N003 N004 dff
XX3 Clk D[2] N005 N006 dff
XX4 Clk D[3] N007 N008 dff
XX5 N001 Q[0] buffer2x
XX6 N002 Qb[0] buffer2x
XX7 N003 Q[1] buffer2x
XX8 N004 Qb[1] buffer2x
XX9 N005 Q[2] buffer2x
XX10 N006 Qb[2] buffer2x
XX11 N007 Q[3] buffer2x
XX12 N008 Qb[3] buffer2x
.ends register

.subckt dff CLK8 D8 Q8 Qbar8
X§X1 D CLK CLKbar Amid nand3
X§X2 CLKbar CLK Dbar Bmid nand3
X§X5 N004 CLKbar invert
X§X6 N003 N004 invert
X§X7 N002 N003 invert
X§X8 N001 N002 invert
X§X9 CLK N001 invert
X§X3 Amid Qbar Q nand
X§X4 Q Bmid Qbar nand
X§X10 D Dbar invert
.ends dff

.subckt nand3 A B C NAND3
XX1 A B N001 nand
XX1 N002 C NAND3 nand
XX1 N001 N002 invert
.ends nand3

.subckt nand A B NAND
M1 NAND A N001 N001 Sp2025P
M2 NAND B N001 N001 Sp2025P
M3 NAND A N002 N002 Sp2025N
M4 N002 B 0 0 Sp2025N
V1 N001 0 V
.ends nand

.subckt invert A NA
M§X1 NA A N001 N001 Sp2025P
M§X1 NA A 0 0 Sp2025N
V§X1 N001 0 5
.ends invert

.subckt buffer2x Bufi Bufo
XX1 Bufi N003 invert
XX1 N003 N002 invert
XX1 N003 N002 invert
XX1 N003 N002 invert
XX1 N002 N001 invert
XX1 N002 N001 invert
XX1 N002 N001 invert
XX1 N002 N001 invert
XX1 N002 N001 invert
XX1 N002 N001 invert
XX1 N002 N001 invert
XX1 N001 Bufo invert
XX1 N001 Bufo invert
XX1 N001 Bufo invert
XX1 N001 Bufo invert
XX1 N001 Bufo invert
XX1 N001 Bufo invert
XX1 N001 Bufo invert
XX1 N001 Bufo invert
XX1 N001 Bufo invert
XX1 N001 Bufo invert
XX1 N001 Bufo invert
XX1 N001 Bufo invert
XX1 N001 Bufo invert
XX1 N001 Bufo invert
.ends buffer2x

.subckt mux4 A[3] A[2] A[1] A[0] B[3] B[2] B[1] B[0] Sel Out[3] Out[2] Out[1] Out[0]
XX1 A[0] B[0] Sel N001 mux
XX2 A[1] B[1] Sel N002 mux
XX3 A[2] B[2] Sel N003 mux
XX4 A[3] B[3] Sel N004 mux
XX5 N001 Out[0] buffer
XX6 N002 Out[1] buffer
XX7 N003 Out[2] buffer
XX8 N004 Out[3] buffer
.ends mux4

.subckt mux A B Sel MUX
XX1 A Sel N001 nand
XX2 N003 B N002 nand
XX3 N001 N002 MUX nand
XX4 Sel N003 invert
.ends mux

.subckt buffer Bufi Bufo
XX1 Bufi N001 invert
XX2 N001 Bufo invert
XX3 N001 Bufo invert
XX4 N001 Bufo invert
.ends buffer

.subckt nor A8 B8 NOR8
M§X1 NOR A N002 N002 Sp2025P
M§X1 N002 B N001 N001 Sp2025P
M§X1 NOR A 0 0 Sp2025N
M§X1 NOR B 0 0 Sp2025N
V§X1 N001 0 5
.ends nor

.model NMOS NMOS
.model PMOS PMOS
.lib standard.mos
.param clkmult = 1
Vclk Clk 0 PULSE(0 5 0 1n 1n {clkmult*0.5m} {clkmult*1m})
VSa0 SelA[0] 0 PULSE(0 5 0 1n 1n {clkmult*0.5m} {clkmult*1m})
VSa1 SelA[1] 0 PULSE(0 5 0 1n 1n {clkmult*1m} {clkmult*2m})
VSb0 SelB[0] 0 PULSE(0 5 0 1n 1n {clkmult*0.5m} {clkmult*1m})
VSb1 SelB[1] 0 PULSE(0 5 0 1n 1n {clkmult*1m} {clkmult*2m})
VWe We 0 PULSE(0 5 4m 1n 1n {clkmult*20m} {clkmult*40m})
VWrAdd0 WrAddr[0] 0 PULSE(0 5 0.2m 1n 1n {clkmult*2m} {clkmult*4m})
VWrAdd1 WrAddr[1] 0 PULSE(0 5 0.2m 1n 1n {clkmult*4m} {clkmult*8m})
VD3 D[3] 0 5
VD2 D[2] 0 5
VD1 D[1] 0 0
VD0 D[0] 0 5
.inc C:\Users\tsmil\bzrestore_2022_07_01\C\Users\tsmilkst\tsmilkRestore\C\Users\tsmilkst\Cuesta\ClassStuff\CIS240\Labs\LogicLibrary\ModelSp2025.txt
.tran 80m
.backanno
.end